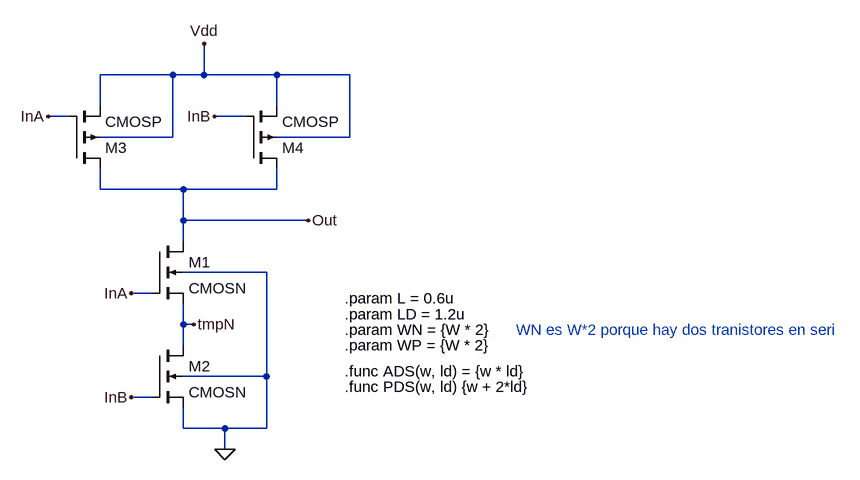
[diagram p0: schematic nand.asc]
nand.asc, the LTspice schematic file:
Version 4
SHEET 1 1596 680
WIRE 528 0 416 0
WIRE 576 0 576 -48
WIRE 576 0 528 0
WIRE 688 0 576 0
WIRE 800 0 688 0
WIRE 416 48 416 0
WIRE 688 48 688 0
WIRE 368 64 336 64
WIRE 640 64 592 64
WIRE 528 96 528 0
WIRE 528 96 416 96
WIRE 800 96 800 0
WIRE 800 96 688 96
WIRE 416 176 416 144
WIRE 544 176 416 176
WIRE 688 176 688 144
WIRE 688 176 544 176
WIRE 544 224 544 176
WIRE 736 224 544 224
WIRE 544 256 544 224
WIRE 672 304 544 304
WIRE 496 336 464 336
WIRE 544 384 544 352
WIRE 560 384 544 384
WIRE 544 416 544 384
WIRE 672 464 672 304
WIRE 672 464 544 464
WIRE 496 496 464 496
WIRE 544 544 544 512
WIRE 608 544 544 544
WIRE 672 544 672 464
WIRE 672 544 608 544
WIRE 608 576 608 544
FLAG 464 336 InA
FLAG 736 224 Out
FLAG 464 496 InB
FLAG 560 384 tmpN
FLAG 336 64 InA
FLAG 592 64 InB
FLAG 576 -48 Vdd
FLAG 608 576 0
SYMBOL nmos4 496 256 R0
SYMATTR InstName M1
SYMATTR Value CMOSN
SYMATTR Value2 l={L} w={WN} ad={ADS(WN, LD)} as={ADS(WN, LD)} pd={PDS(WN, LD)} ps={PDS(WN, LD)}
SYMBOL pmos4 368 144 M180
SYMATTR InstName M3
SYMATTR Value CMOSP
SYMATTR Value2 l={L} w={WP} ad={ADS(WP, LD)} as={ADS(WP, LD)} pd={PDS(WP, LD)} ps={PDS(WP, LD)}
SYMBOL nmos4 496 416 R0
SYMATTR InstName M2
SYMATTR Value CMOSN
SYMATTR Value2 l={L} w={WN} ad={ADS(WN, LD)} as={ADS(WN, LD)} pd={PDS(WN, LD)} ps={PDS(WN, LD)}
SYMBOL pmos4 640 144 M180
SYMATTR InstName M4
SYMATTR Value CMOSP
SYMATTR Value2 l={L} w={WP} ad={ADS(WP, LD)} as={ADS(WP, LD)} pd={PDS(WP, LD)} ps={PDS(WP, LD)}
TEXT 792 456 Left 2 !.func ADS(w, ld) = {w * ld}
TEXT 792 480 Left 2 !.func PDS(w, ld) {w + 2*ld}
TEXT 792 368 Left 2 !.param LD = 1.2u
TEXT 792 392 Left 2 !.param WN = {W * 2}
TEXT 792 344 Left 2 !.param L = 0.6u
TEXT 792 416 Left 2 !.param WP = {W * 2}
TEXT 1056 392 Left 2 ;WN es W*2 porque hay dos tranistores en seri

The netlist it stands for:
* nand.asc
M1 Out InA tmpN 0 CMOSN l={L} w={WN} ad={ADS(WN, LD)} as={ADS(WN, LD)} pd={PDS(WN, LD)} ps={PDS(WN, LD)}
M3 Out InA Vdd Vdd CMOSP l={L} w={WP} ad={ADS(WP, LD)} as={ADS(WP, LD)} pd={PDS(WP, LD)} ps={PDS(WP, LD)}
M2 tmpN InB 0 0 CMOSN l={L} w={WN} ad={ADS(WN, LD)} as={ADS(WN, LD)} pd={PDS(WN, LD)} ps={PDS(WN, LD)}
M4 Out InB Vdd Vdd CMOSP l={L} w={WP} ad={ADS(WP, LD)} as={ADS(WP, LD)} pd={PDS(WP, LD)} ps={PDS(WP, LD)}
.model NMOS NMOS
.model PMOS PMOS
.lib standard.mos
.func ADS(w, ld) = {w * ld}
.func PDS(w, ld) {w + 2*ld}
.param LD = 1.2u
.param WN = {W * 2}
.param L = 0.6u
.param WP = {W * 2}
* WN es W*2 porque hay dos tranistores en seri
.backanno
.end